# EAGLE design PCB-CARR-CMB-2band3 (EAGLE 6.5.0)

## Sheet 1 of 2
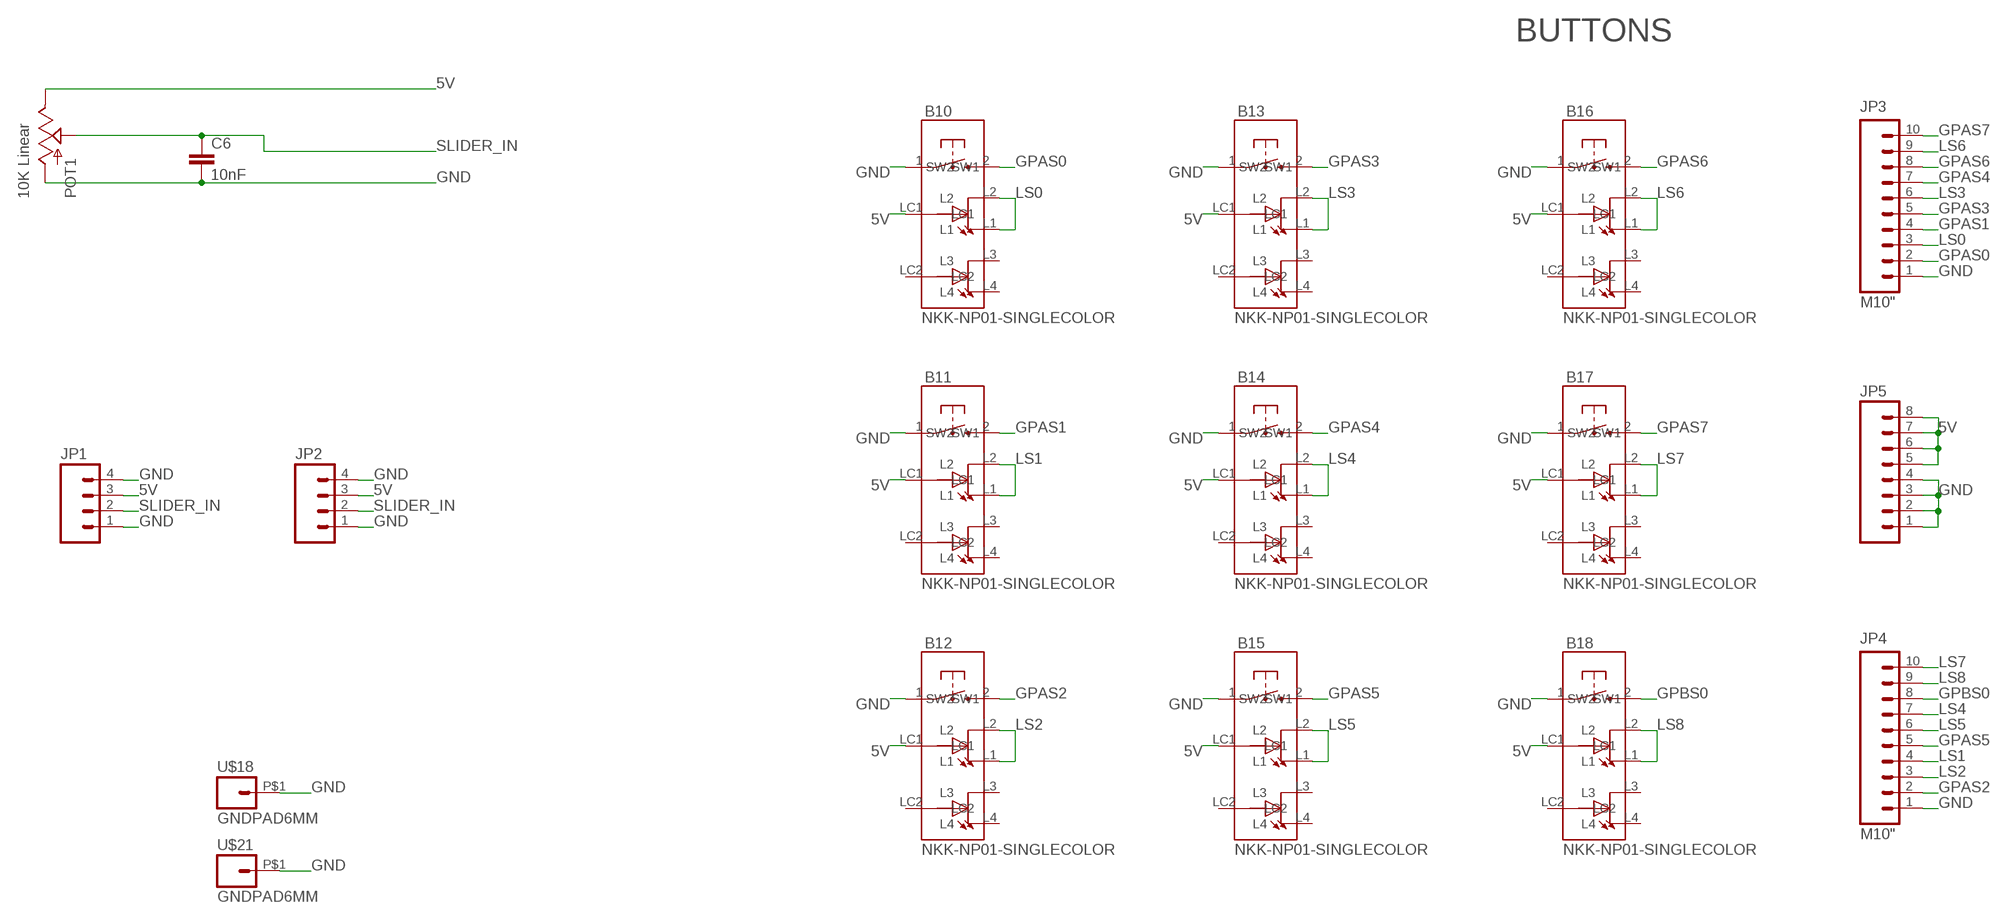
[diagram p0: schematic, sheet 1]

### Parts
B10  NKK-NP01-SINGLECOLOR  [NKK-NP01]
B11  NKK-NP01-SINGLECOLOR  [NKK-NP01]
B12  NKK-NP01-SINGLECOLOR  [NKK-NP01]
B13  NKK-NP01-SINGLECOLOR  [NKK-NP01]
B14  NKK-NP01-SINGLECOLOR  [NKK-NP01]
B15  NKK-NP01-SINGLECOLOR  [NKK-NP01]
B16  NKK-NP01-SINGLECOLOR  [NKK-NP01]
B17  NKK-NP01-SINGLECOLOR  [NKK-NP01]
B18  NKK-NP01-SINGLECOLOR  [NKK-NP01]
C6  10nF  CAP0603-CAP  [0603-CAP]
JP1  M04PTH  [1X04]
JP2  M04PTH  [1X04]
JP3  M10"  [1X10]
JP4  M10"  [1X10]
JP5  M08LOCK  [1X08_LOCK]
POT1  10K Linear  SLIDER20  [SLIDER20]
U$18  GNDPAD6MM  [3.2MMPAD6MM]
U$21  GNDPAD6MM  [3.2MMPAD6MM]

### Nets
5V [Power]: B10.LC1 B11.LC1 B12.LC1 B13.LC1 B14.LC1 B15.LC1 B16.LC1 B17.LC1 B18.LC1 JP1.3 JP2.3 JP5.5 JP5.6 JP5.7 JP5.8 POT1.1(E)
GND [Power]: B10.1(SW1) B11.1(SW1) B12.1(SW1) B13.1(SW1) B14.1(SW1) B15.1(SW1) B16.1(SW1) B17.1(SW1) B18.1(SW1) C6.2 JP1.1 JP1.4 JP2.1 JP2.4 JP3.1 JP4.1 JP5.1 JP5.2 JP5.3 JP5.4 POT1.3(A) U$18.P$1 U$21.P$1
GPAS0: B10.2(SW2) JP3.2
GPAS1: B11.2(SW2) JP3.4
GPAS2: B12.2(SW2) JP4.2
GPAS3: B13.2(SW2) JP3.5
GPAS4: B14.2(SW2) JP3.7
GPAS5: B15.2(SW2) JP4.5
GPAS6: B16.2(SW2) JP3.8
GPAS7: B17.2(SW2) JP3.10
GPBS0 [Power]: B18.2(SW2) JP4.8
LS0: B10.L1 B10.L2 JP3.3
LS1: B11.L1 B11.L2 JP4.4
LS2: B12.L1 B12.L2 JP4.3
LS3: B13.L1 B13.L2 JP3.6
LS4: B14.L1 B14.L2 JP4.7
LS5: B15.L1 B15.L2 JP4.6
LS6: B16.L1 B16.L2 JP3.9
LS7: B17.L1 B17.L2 JP4.10
LS8: B18.L1 B18.L2 JP4.9
SLIDER_IN: C6.1 JP1.2 JP2.2 POT1.2A(S)
Unconnected: B10.L3 B10.L4 B10.LC2 B11.L3 B11.L4 B11.LC2 B12.L3 B12.L4 B12.LC2 B13.L3 B13.L4 B13.LC2 B14.L3 B14.L4 B14.LC2 B15.L3 B15.L4 B15.LC2 B16.L3 B16.L4 B16.LC2 B17.L3 B17.L4 B17.LC2 B18.L3 B18.L4 B18.LC2

### Notes on the sheet
- BUTTONS

## Sheet 2 of 2

## Library data of the parts
B10-B18 = SKAARHOJ:NKK-NP01-SINGLECOLOR
C6 = SparkFun:CAP: Capacitor Standard 0603 ceramic capacitor, and 0.1" leaded capacitor.
JP1 JP2 = SparkFun:M04: Header 4 Standard 4-pin 0.1" header. Use with straight break away headers (SKU : PRT-00116), right angle break away headers (PRT-00553), swiss pins (PRT-00743), machine pins (PRT-00117), and female headers (PRT-00115). Molex polarized connector foot print use with SKU : PRT-08231 with associated crimp pins and housings. 1MM SMD Version SKU: PRT-10208
JP3 JP4 = SparkFun:M10: Header 10 Standard 10-pin 0.1" header. Use with straight break away headers (SKU : PRT-00116), right angle break away headers (PRT-00553), swiss pins (PRT-00743), machine pins (PRT-00117), and female headers (PRT-00115).
JP5 = SparkFun:M08: Header 8 Standard 8-pin 0.1" header. Use with straight break away headers (SKU : PRT-00116), right angle break away headers (PRT-00553), swiss pins (PRT-00743), machine pins (PRT-00117), and female headers (PRT-00115).
POT1 = SKAARHOJ:SLIDER
U$18 U$21 = SKAARHOJ:GNDPAD

## Net classes
0 default: width 0.203 mm, drill 0.406 mm, clearance 0.203 mm
1 Power: width 0.406 mm, drill 0.61 mm, clearance 0.203 mm

## Board
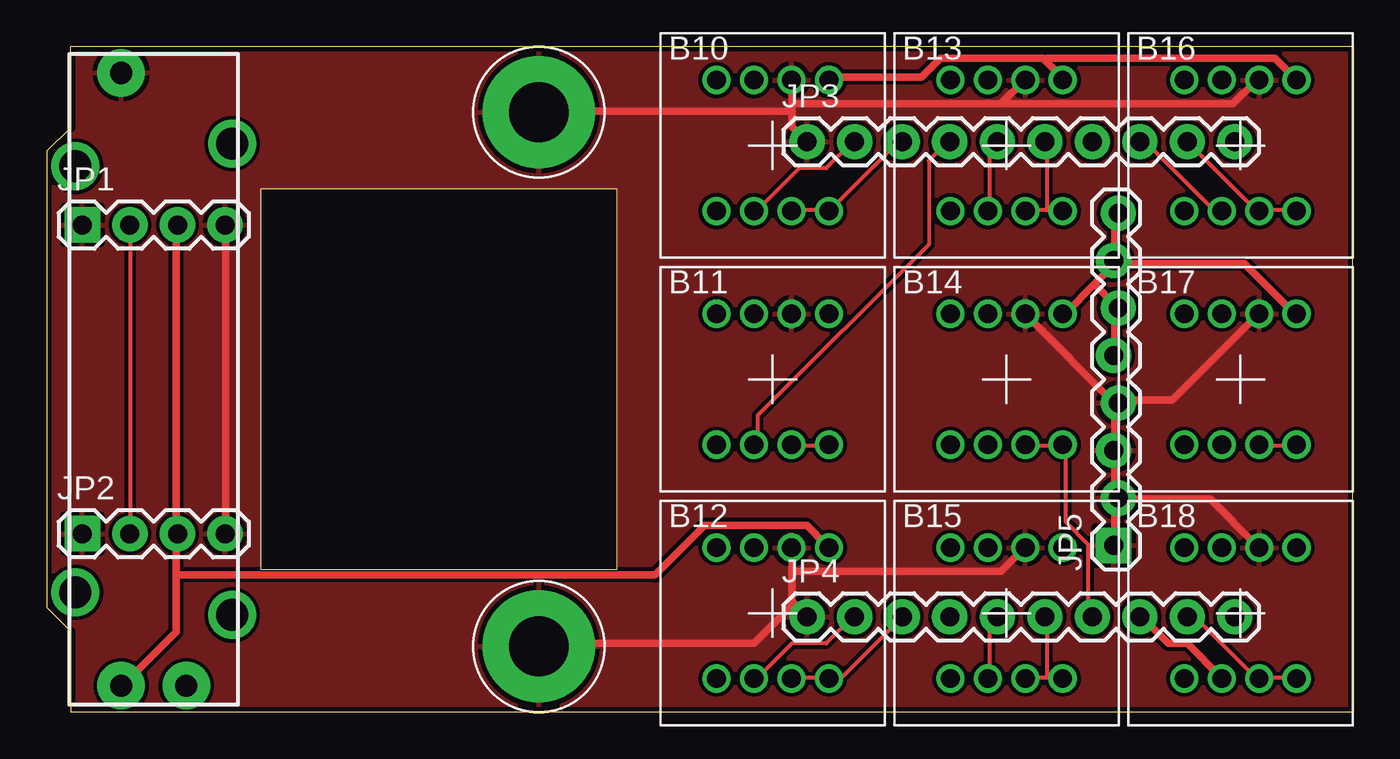
[diagram p1: board, top side]
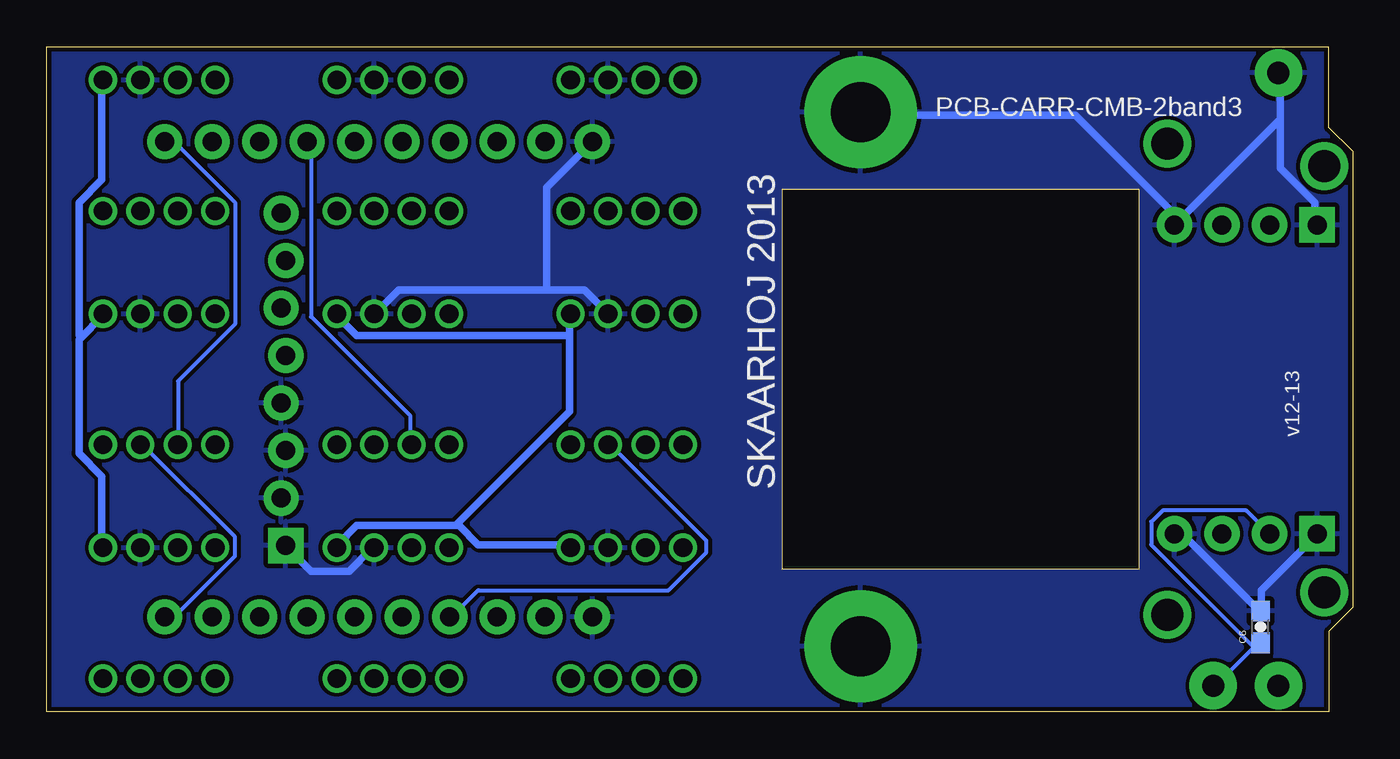
[diagram p2: board, bottom side, seen from below]

Size 69.8 x 35.56 mm. Coordinates in mm from the lower left corner, seen from the top.
Outline: 1.27,0 69.8,0 69.8,35.56 1.27,35.56 1.27,31.24 0,29.97 0,5.59 1.27,4.32 1.27,0
Copper layers (1*16): Top 0.035mm / dielectric 1.5mm / Bottom 0.035mm
Design rules "Fusion_eagle_rule_v1.1": minimum track width 6mil, minimum drill 12mil, track to track 6mil, track to pad 6mil, pad to pad 6mil, via to via 6mil, smd to smd 0mil, copper to edge 10mil, drill to drill 10mil, minimum pad ring 10mil, minimum via ring 6mil, stop-mask expansion 2mil, vias tented up to drill 100mil, thermal gap 10mil
tRestrict: area 11.4,7.6 to 30.5,27.9
bRestrict: area 11.4,7.6 to 30.5,27.9
Milling: area 11.4,7.6 to 30.5,27.9

### Footprints (pad centres in the part's own frame; a part is rotated, then mirrored left to right if it is on the bottom)
NKK-NP01 = drill 1: 1 1,3.5; 2 -1,-3.5; L1 3,-3.5; L2 1,-3.5; L3 -1,3.5; L4 -3,3.5; LC1 3,3.5; LC2 -3,-3.5
0603-CAP = smd 1.1 x 1: 1 -0.85,0; 2 0.85,0
1X04 = drill 1.016 pad 1.88 square: 1 0,0 | drill 1.016 pad 1.88: 2 2.54,0; 3 5.08,0; 4 7.62,0
1X10 = drill 1.016 pad 1.88: 1 0,0; 2 2.54,0; 3 5.08,0; 4 7.62,0; 5 10.16,0; 6 12.7,0; 7 15.24,0; 8 17.78,0; 9 20.32,0; 10 22.86,0
1X08_LOCK = drill 1.016 pad 1.88 square: 1 0,0.127 | drill 1.016 pad 1.88: 2 2.54,-0.127; 3 5.08,0.127; 4 7.62,-0.127; 5 10.16,0.127; 6 12.7,-0.127; 7 15.24,0.127; 8 17.78,-0.127
SLIDER20 = drill 1.194 pad 2.54: 1 -16.383,1.74; 2A -16.383,-1.74; 3 16.383,1.74 | drill 1.702: P$1 -11.392,4.191; P$2 11.392,4.191; P$3 12.598,-4.191; P$4 -12.598,-4.191
3.2MMPAD6MM = drill 3.2 pad 6: P$1 0,0

### Placement (x,y rotation side)
B10  38.8,30.28 0 top
B11  38.8,17.78 0 top
B12  38.8,5.28 0 top
B13  51.3,30.28 0 top
B14  51.3,17.78 0 top
B15  51.3,5.28 0 top
B16  63.8,30.28 0 top
B17  63.8,17.78 0 top
B18  63.8,5.28 0 top
C6  4.93,4.54 90 bottom
JP1  1.91,26.04 0 top
JP2  1.91,9.53 0 top
JP3  40.64,30.48 0 top
JP4  40.64,5.08 0 top
JP5  57.15,8.89 90 top
POT1  5.71,17.78 90 top
U$18  26.3,3.5 0 top
U$21  26.3,32.06 0 top

### Tracks (layer width: path | path; a pad name or v marks a point on that pad's centre or on a via)
5V
  Top 0.406: 6.91,7.32 6.91,4.27 4.06,1.42 POT1.1 | 6.91,7.32 6.91,9.35 JP2.3 6.91,9.55 6.91,26.01 JP1.3 | 53.34,34.85 54.25,33.93 B13.LC1 | 53.34,34.85 53.24,34.95 47.75,34.95 46.74,33.93 41.86,33.93 B10.LC1 | B16.LC1 66.65,33.93 65.63,34.95 53.44,34.95 53.34,34.85 | JP5.5 57.1,19.1 57.1,21.54 JP5.6 57.1,21.74 55.98,22.86 | 55.98,22.86 57.1,23.98 JP5.7 | 55.98,22.86 54.46,21.34 B14.LC1 | JP5.8 57.1,26.62 57.1,24.18 JP5.7 | JP5.7 57.3,23.98 64.01,23.98 66.65,21.34 B17.LC1 | 6.91,7.32 32.51,7.32 35.15,9.96 40.64,9.96 41.66,8.94 B12.LC1
  Bottom 0.406: 47.95,9.96 53.24,9.96 54.25,8.94 B15.LC1 | 47.95,9.96 47.75,9.96 46.74,8.94 41.86,8.94 B12.LC1 | 41.86,20.12 41.86,16.05 47.95,9.96 | 41.86,20.12 41.86,21.13 B11.LC1 | 67.97,20.02 66.85,21.13 B17.LC1 | 67.97,20.02 68.07,19.91 68.07,13.82 66.85,12.6 66.85,8.94 B18.LC1 | 41.86,20.12 53.24,20.12 54.25,21.13 B14.LC1 | B16.LC1 66.85,33.73 66.85,28.45 68.07,27.23 68.07,20.12 67.97,20.02
GND
  Top 0.406: 39.83,7.52 39.83,5.89 39.93,5.79 | 39.83,7.52 39.83,8.74 B12.1 | JP4.1 39.93,5.79 | 39.83,7.52 51,7.52 52.22,8.74 B15.1 | B18.1 64.62,8.94 62.18,11.38 57.3,11.38 JP5.2 | JP5.2 57.1,11.58 57.1,13.82 JP5.3 57.1,14.02 57.1,16.26 JP5.4 | B17.1 64.62,21.13 60.15,16.66 57.3,16.66 JP5.4 | B14.1 52.43,21.13 57.1,16.46 JP5.4 | JP5.1 57.1,8.94 57.1,11.38 JP5.2 | 39.93,5.79 37.8,3.66 26.42,3.66 U$18.P$1 | JP2.4 9.55,9.55 9.55,26.01 JP1.4 | 39.83,32.11 39.83,31.29 JP3.1 | 39.83,32.11 39.83,32.51 | 39.83,32.51 39.83,33.73 B10.1 | 51.1,32.61 51,32.51 39.83,32.51 | 51.1,32.61 52.22,33.73 B13.1 | B16.1 64.62,33.73 63.4,32.51 51.21,32.51 51.1,32.61 | 39.83,32.11 26.42,32.11 U$21.P$1
  Bottom 0.406: B15.1 52.43,8.74 53.65,7.52 55.68,7.52 56.9,8.74 JP5.1 | 43.08,22.55 51,22.55 52.22,21.34 B14.1 | 43.08,22.55 41.05,22.55 39.83,21.34 B11.1 | JP2.1 2.03,9.35 4.88,6.5 4.88,5.49 C6.2 5.08,5.49 8.94,9.35 9.35,9.35 JP2.4 | 3.86,31.7 3.86,34.14 POT1.3 | 3.86,31.7 3.86,29.06 2.03,27.23 2.03,26.21 JP1.1 | 3.86,31.7 JP1.4 9.35,26.42 14.83,31.9 26.21,31.9 U$21.P$1 | 43.08,22.55 43.08,28.04 JP3.1
  pour Top: 0,0 69.85,0 69.85,35.56 0,35.56
  pour Bottom: 0,0 69.85,0 69.85,35.56 0,35.56
GPAS0
  Top 0.203: B10.2 38,26.82 40.23,29.06 41.66,29.06 43.08,30.48 JP3.2
GPAS1
  Top 0.203: B11.2 38,14.43 38,15.85 47.14,24.99 47.14,29.46 48.16,30.48 JP3.4
GPAS2
  Top 0.203: B12.2 38,1.83 39.83,3.66 41.66,3.66 43.08,5.08 JP4.2
GPAS3
  Top 0.203: JP3.5 50.39,30.07 50.39,26.82 B13.2
GPAS4
  Bottom 0.203: JP3.7 55.68,30.28 55.68,21.13 50.39,15.85 50.39,14.43 B14.2
GPAS5
  Top 0.203: JP4.5 50.39,4.67 50.39,1.83 B15.2
GPAS6
  Top 0.203: JP3.8 58.73,30.48 62.38,26.82 62.79,26.82 B16.2
GPAS7
  Bottom 0.203: JP3.10 62.99,30.48 59.74,27.23 59.74,20.73 62.79,17.68 62.79,14.43 B17.2
GPBS0
  Top 0.406: B18.2 62.79,1.83 60.96,3.66 59.94,3.66 58.52,5.08 JP4.8
LS0
  Top 0.203: B10.L2 39.83,26.82 41.66,26.82 B10.L1 41.86,26.82 45.52,30.48 JP3.3
LS1
  Top 0.203: B11.L2 39.83,14.22 41.66,14.22 B11.L1
  Bottom 0.203: B11.L2 39.62,14.22 34.54,9.14 34.54,8.53 36.58,6.5 46.74,6.5 48.16,5.08 JP4.4
LS2
  Top 0.203: B12.L2 39.83,1.83 41.66,1.83 B12.L1 41.86,1.83 42.47,1.83 JP4.3
LS3
  Top 0.203: 53.44,26.82 54.25,26.82 B13.L1 | 53.44,26.82 52.43,26.82 B13.L2 | 53.44,26.82 53.44,30.48 JP3.6
LS4
  Top 0.203: B14.L2 52.43,14.22 54.25,14.22 B14.L1 54.46,14.22 54.46,10.16 55.68,8.94 55.68,5.28 JP4.7
LS5
  Top 0.203: 53.44,1.83 54.25,1.83 B15.L1 | 53.44,1.83 52.43,1.83 B15.L2 | 53.44,1.83 53.44,5.08 JP4.6
LS6
  Top 0.203: B16.L1 66.65,26.82 64.82,26.82 B16.L2 64.62,26.82 JP3.9
LS7
  Top 0.203: B17.L2 64.82,14.22 66.65,14.22 B17.L1
  Bottom 0.203: JP4.10 62.99,5.08 59.74,8.33 59.74,9.35 64.62,14.22 B17.L2
LS8
  Top 0.203: B18.L1 66.65,1.83 64.82,1.83 B18.L2 64.62,1.83 61.37,5.08 JP4.9
SLIDER_IN
  Top 0.203: JP2.2 4.47,9.55 4.47,26.01 JP1.2
  Bottom 0.203: 5.28,3.45 7.32,1.42 POT1.2A | 5.28,3.45 5.08,3.66 C6.1 5.28,3.45 | 5.28,3.45 10.77,8.94 10.77,10.16 10.16,10.77 5.69,10.77 JP2.2

### Text on the board
_bsilk: PCB-CARR-CMB-2band3 | SKAARHOJ 2013 | v12-13